# Altium schematic sheet ClockGen.SchDoc
size A4; SheetNumber: 3; SheetTotal: 6
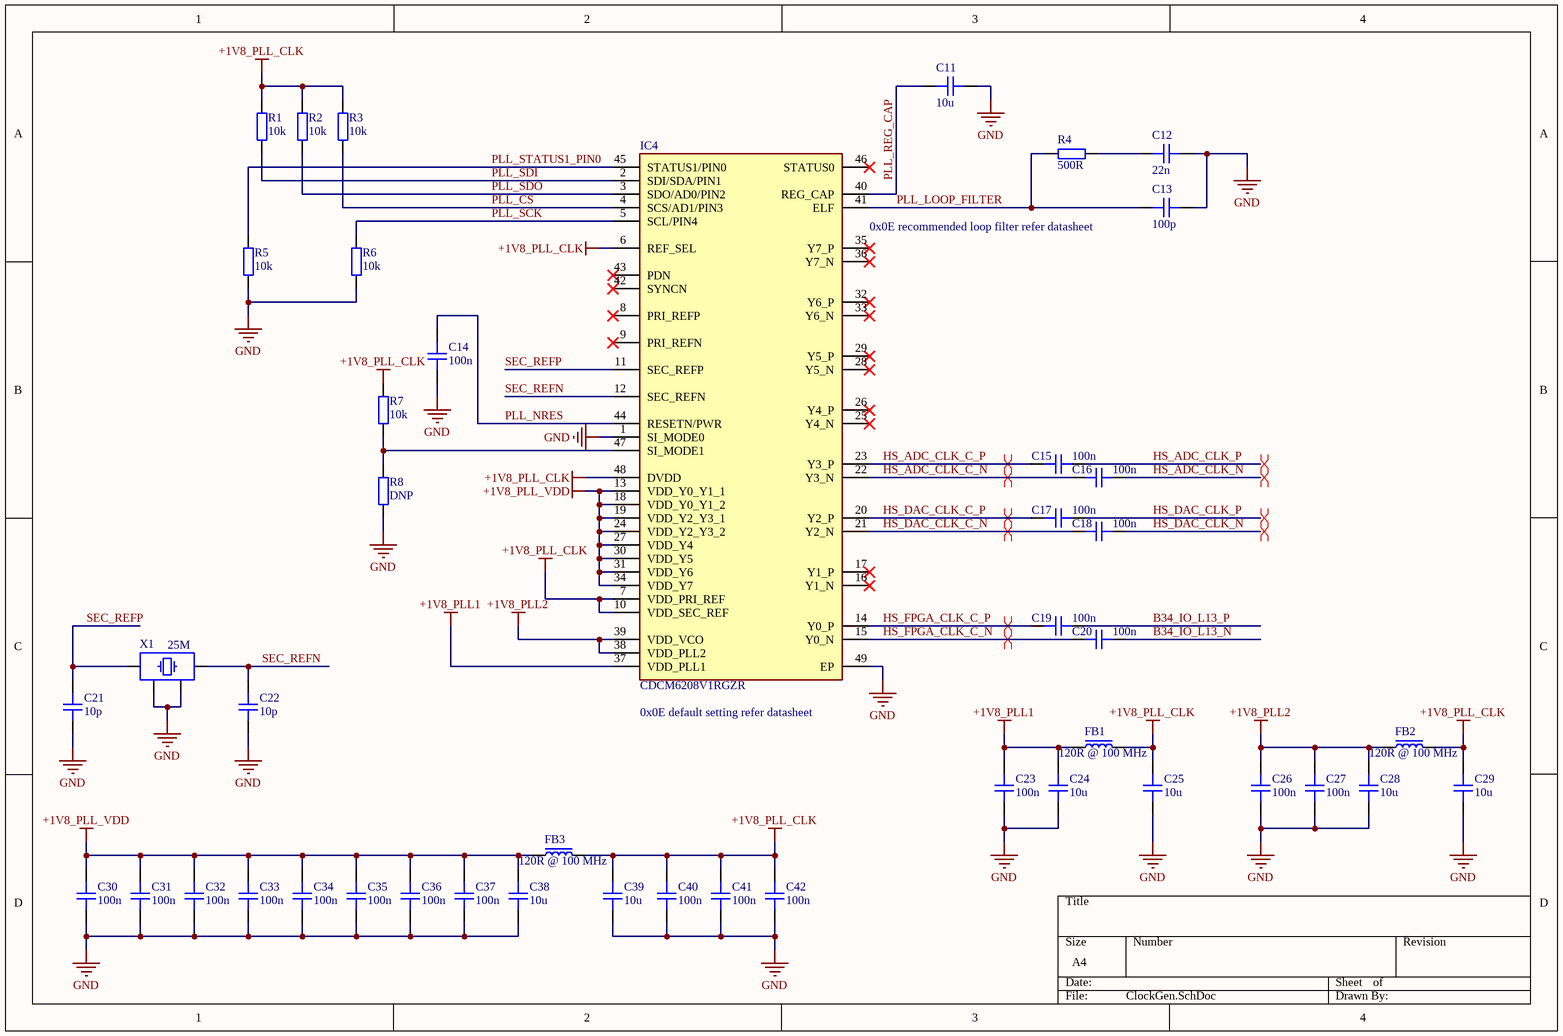
[diagram p0: ClockGen.SchDoc]

## Parts
C11  10u  [CAP_0603]
C12  22n  [CAP_0402]
C13  100p  [CAP_0402]
C14  100n  [CAP_0402]
C15  100n  [CAP_0402]
C16  100n  [CAP_0402]
C17  100n  [CAP_0402]
C18  100n  [CAP_0402]
C19  100n  [CAP_0402]
C20  100n  [CAP_0402]
C21  10p  [CAP_0402]
C22  10p  [CAP_0402]
C23  100n  [CAP_0402]
C24  10u  [CAP_0603]
C25  10u  [CAP_0603]
C26  100n  [CAP_0402]
C27  100n  [CAP_0402]
C28  10u  [CAP_0603]
C29  10u  [CAP_0603]
C30  100n  [CAP_0402]
C31  100n  [CAP_0402]
C32  100n  [CAP_0402]
C33  100n  [CAP_0402]
C34  100n  [CAP_0402]
C35  100n  [CAP_0402]
C36  100n  [CAP_0402]
C37  100n  [CAP_0402]
C38  10u  [CAP_0603]
C39  10u  [CAP_0603]
C40  100n  [CAP_0402]
C41  100n  [CAP_0402]
C42  100n  [CAP_0402]
FB1  120R @ 100 MHz  [FB_0603]
FB2  120R @ 100 MHz  [FB_0603]
FB3  120R @ 100 MHz  [FB_0603]
IC4  CDCM6208V1RGZR  [QFN50P700X700X100-49N-D - duplicate]
R1  10k  [RES_0402]
R2  10k  [RES_0402]
R3  10k  [RES_0402]
R4  500R  [RES_0402]
R5  10k  [RES_0402]
R6  10k  [RES_0402]
R7  10k  [RES_0402]
R8  DNP  [RES_0402]
X1  25M  [XTAL_3225]

## Nets
+1V8_PLL1: C23.1 C24.2 FB1.1 IC4.37(VDD_PLL1)
+1V8_PLL2: C26.1 C27.1 C28.2 FB2.1 IC4.38(VDD_PLL2) IC4.39(VDD_VCO)
+1V8_PLL_CLK: C25.2 C29.2 C39.2 C40.1 C41.1 C42.1 FB1.2 FB2.2 FB3.2 IC4.6(REF_SEL) IC4.7(VDD_PRI_REF) IC4.10(VDD_SEC_REF) IC4.48(DVDD) R1.2 R2.2 R3.2 R7.2
+1V8_PLL_VDD: C30.1 C31.1 C32.1 C33.1 C34.1 C35.1 C36.1 C37.1 C38.2 FB3.1 IC4.13(VDD_Y0_Y1_1) IC4.18(VDD_Y0_Y1_2) IC4.19(VDD_Y2_Y3_1) IC4.24(VDD_Y2_Y3_2) IC4.27(VDD_Y4) IC4.30(VDD_Y5) IC4.31(VDD_Y6) IC4.34(VDD_Y7)
GND: C11.2 C12.1 C13.1 C14.1 C21.2 C22.2 C23.2 C24.1 C25.1 C26.2 C27.2 C28.1 C29.1 C30.2 C31.2 C32.2 C33.2 C34.2 C35.2 C36.2 C37.2 C38.1 C39.1 C40.2 C41.2 C42.2 IC4.1(SI_MODE0) IC4.49(EP) R5.1 R6.1 R8.1 X1.2 X1.4
B34_IO_L13_N: C20.1
B34_IO_L13_P: C19.1
HS_ADC_CLK_C_N: C16.2 IC4.22(Y3_N)
HS_ADC_CLK_C_P: C15.2 IC4.23(Y3_P)
HS_ADC_CLK_N: C16.1
HS_ADC_CLK_P: C15.1
HS_DAC_CLK_C_N: C18.2 IC4.21(Y2_N)
HS_DAC_CLK_C_P: C17.2 IC4.20(Y2_P)
HS_DAC_CLK_N: C18.1
HS_DAC_CLK_P: C17.1
HS_FPGA_CLK_C_N: C20.2 IC4.15(Y0_N)
HS_FPGA_CLK_C_P: C19.2 IC4.14(Y0_P)
PLL_CS: IC4.4(SCS/AD1/PIN3) R3.1
PLL_LOOP_FILTER: C13.2 IC4.41(ELF) R4.2
PLL_NRES: C14.2 IC4.44(RESETN/PWR)
PLL_REG_CAP: C11.1 IC4.40(REG_CAP)
PLL_SCK: IC4.5(SCL/PIN4) R6.2
PLL_SDI: IC4.2(SDI/SDA/PIN1) R1.1
PLL_SDO: IC4.3(SDO/AD0/PIN2) R2.1
PLL_STATUS1_PIN0: IC4.45(STATUS1/PIN0) R5.2
SEC_REFN: C22.1 IC4.12(SEC_REFN) X1.3
SEC_REFP: C21.1 IC4.11(SEC_REFP) X1.1
NetC12_2: C12.2 R4.1
NetIC4_47: IC4.47(SI_MODE1) R7.1 R8.2

Not connected (* = marked no-connect by the designer): IC4 8(PRI_REFP)* 9(PRI_REFN)* 16(Y1_N)* 17(Y1_P)* 25(Y4_N)* 26(Y4_P)* 28(Y5_N)* 29(Y5_P)* 32(Y6_P)* 33(Y6_N)* 35(Y7_P)* 36(Y7_N)* 42(SYNCN)* 43(PDN)* 46(STATUS0)*

## Layout directives
differential pair: HS_ADC_CLK_C_N, HS_ADC_CLK_C_P, HS_ADC_CLK_N, HS_ADC_CLK_P, HS_DAC_CLK_C_N, HS_DAC_CLK_C_P, HS_DAC_CLK_N, HS_DAC_CLK_P, HS_FPGA_CLK_C_N, HS_FPGA_CLK_C_P

## Notes on the sheet
- 0x0E recommended loop filter refer datasheet
- (near IC4) 0x0E default setting refer datasheet

## Library data of the parts
C11 C24 C25 C28 C29 C38 C39 = CAP_0603: Capacitor SMD 0603; Manufacturer: *; Manufacturer Part Number: *; Distributor Link: *; LCSC: *; Rating: *; Dielectric: *
C12-C23 C26 C27 C30-C37 C40-C42 = CAP_0402: Capacitor SMD 0402; Manufacturer: *; Manufacturer Part Number: *; Distributor Link: *; LCSC: *; Rating: *; Dielectric: *
FB1-FB3 = FB_0603: Ferrite Bead SMD 0603; Manufacturer: *; Manufacturer Part Number: *; Distributor Link: *; LCSC: *
IC4 = CDCM6208V1RGZR: Integrated Circuit; Manufacturer_Name: Texas Instruments; Datasheet Link: http://www.ti.com/lit/gpn/cdcm6208; Height: 1mm; Manufacturer_Part_Number: CDCM6208V1RGZR; Mouser Part Number: 595-CDCM6208V1RGZR; Mouser Price/Stock: https://www.mouser.co.uk/ProductDetail/Texas-Instruments/CDCM6208V1RGZR?qs=Zv8nmyeoaKuA7Z6bIfs9ug%3D%3D; Arrow Part Number: CDCM6208V1RGZR; Arrow Price/Stock: https://www.arrow.com/en/products/cdcm6208v1rgzr/texas-instruments?region=nac
R1-R8 = RES_0402: Resistor SMD 0402; Manufacturer: *; Manufacturer Part Number: *; Distributor Link: *; LCSC: *
X1 = XTAL_3225: Crystal SMD 3225; Distributor Link: *